# Altium project AudioUSB.PrjPcb
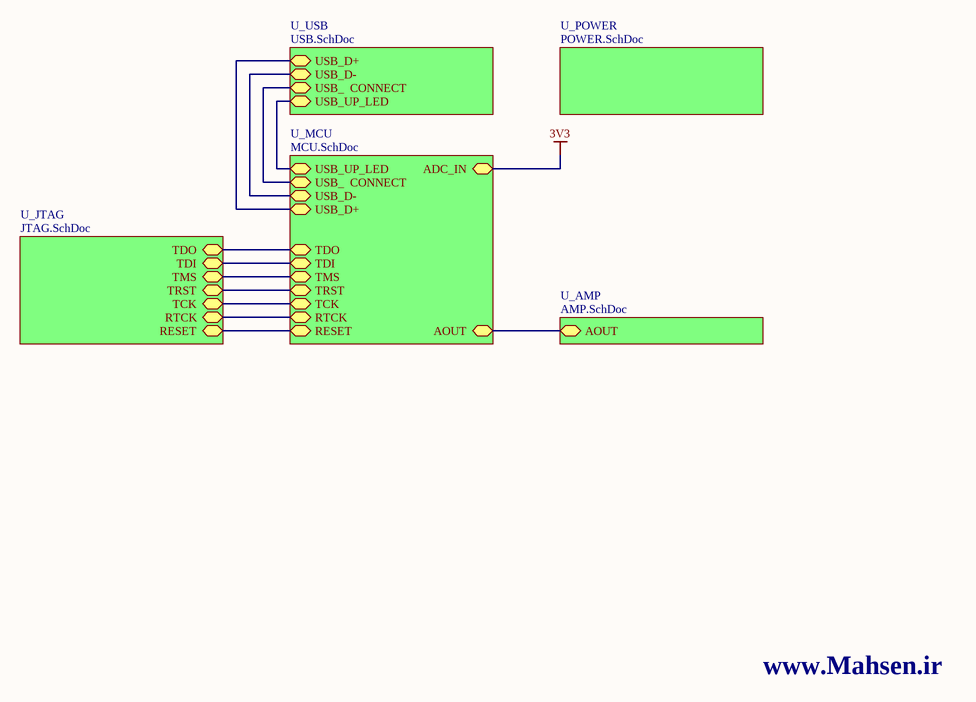
[diagram p0: TopSheet.SchDoc]
6 sheets, 50 parts. Net scope: hierarchical (ports join the sheet entries above them; power ports are global).
Board file: MainPCB.PcbDoc
Sheets:
  TopSheet.SchDoc
    U_AMP = AMP.SchDoc
    U_JTAG = JTAG.SchDoc
    U_MCU = MCU.SchDoc
    U_POWER = POWER.SchDoc
    U_USB = USB.SchDoc

## Sheet TopSheet.SchDoc
size A

### Sub-sheets
U_AMP = AMP.SchDoc: AOUT (bidir)
U_JTAG = JTAG.SchDoc: TDO (bidir), TDI (bidir), TMS (bidir), TRST (bidir), TCK (bidir), RTCK (bidir), RESET (bidir)
U_MCU = MCU.SchDoc: USB_UP_LED (bidir), ADC_IN (bidir), USB_  CONNECT (bidir), AOUT (bidir), USB_D+ (bidir), USB_D- (bidir), TDO (bidir), TDI (bidir), TMS (bidir), TRST (bidir), TCK (bidir), RTCK (bidir), RESET (bidir)
U_POWER = POWER.SchDoc: no entries
U_USB = USB.SchDoc: USB_D+ (bidir), USB_D- (bidir), USB_  CONNECT (bidir), USB_UP_LED (bidir)

### Nets
NetC1_1: sheet U_JTAG/RESET, sheet U_MCU/RESET
NetC15_2: sheet U_AMP/AOUT, sheet U_MCU/AOUT
NetC17_2: sheet U_MCU/USB_D-, sheet U_USB/USB_D-
NetC18_1: sheet U_MCU/USB_D+, sheet U_USB/USB_D+
NetCN2_3: sheet U_JTAG/TRST, sheet U_MCU/TRST
NetCN2_5: sheet U_JTAG/TDI, sheet U_MCU/TDI
NetCN2_7: sheet U_JTAG/TMS, sheet U_MCU/TMS
NetCN2_9: sheet U_JTAG/TCK, sheet U_MCU/TCK
NetCN2_11: sheet U_JTAG/RTCK, sheet U_MCU/RTCK
NetCN2_13: sheet U_JTAG/TDO, sheet U_MCU/TDO
NetU1_32: sheet U_MCU/USB_UP_LED, sheet U_USB/USB_UP_LED
NetU1_64: sheet U_MCU/USB_  CONNECT, sheet U_USB/USB_  CONNECT

### Notes on the sheet
- www.Mahsen.ir

## Sheet AMP.SchDoc
size A
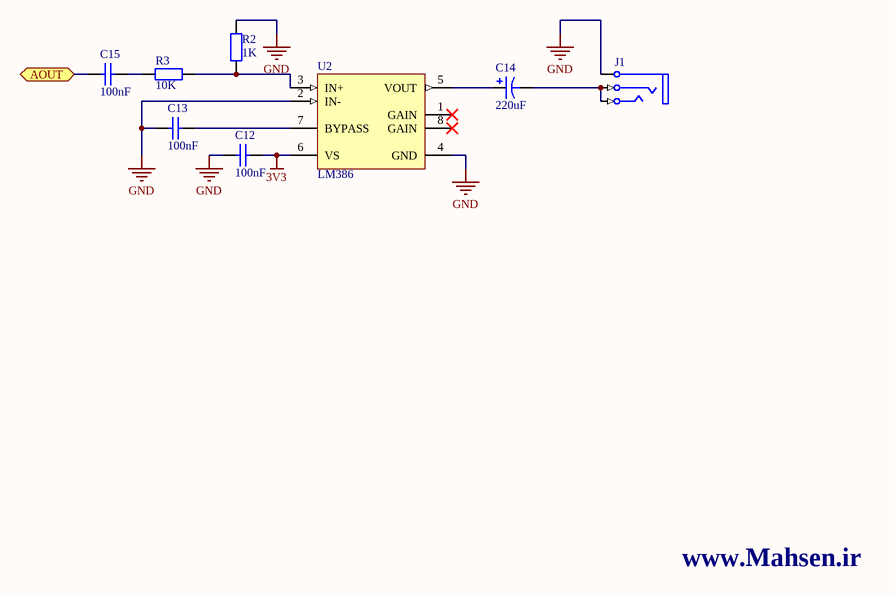
[diagram p1: AMP.SchDoc]

### Parts
C12  100nF  [0805]
C13  100nF  [0805]
C14  220uF  [C0805]
C15  100nF  [0805]
J1  Phonejack3  [JACK/6-V3]  (value not drawn)
R2  1K  [0805]
R3  10K  [0805]
U2  LM386  [M08A_L]

### Ports
AOUT (bidir)

### Nets
3V3: C12.1 U2.6(VS)
GND: C12.2 C13.2 J1.5(S) R2.2 U2.2(IN-) U2.4(GND)
NetC13_1: C13.1 U2.7(BYPASS)
NetC14_1: C14.1 U2.5(VOUT)
NetC14_2: C14.2 J1.1(T) J1.3(R)
NetC15_1: C15.1 R3.1
NetC15_2: C15.2 ; port AOUT
NetR2_1: R2.1 R3.2 U2.3(IN+)

Not connected (* = marked no-connect by the designer): U2 1(GAIN)* 8(GAIN)*

### Notes on the sheet
- www.Mahsen.ir

### Library data of the parts
C12 C13 C15 = Cap: Capacitor; Published: 8-Jun-2000; LatestRevisionDate: 17-Jul-2002; LatestRevisionNote: Re-released for DXP Platform.; PackageReference: RAD-0.3; Publisher: Altium Limited; PackageDescription: Radial Cap, Thru-Hole; 2 Leads; 0.3 in Pin Spacing; Value: 100nF
C14 = Cap Pol3: Polarized Capacitor (Surface Mount); Published: 8-Jun-2000; LatestRevisionDate: 29-May-2009; LatestRevisionNote: IPC-7351 Footprint Added.; PackageReference: C0805; Publisher: Altium Limited; PackageDescription: Chip Capacitor; Value: 220uF
J1 = Phonejack3: Jack Socket, 1/4" [6.5mm], Thru-Hole, Vertical, 3-Conductor Open Circuit (Non-Normalling); PackageDocument: 2003; PCB_Layout: Complies with manufacturer's recommendation.; DrillAndSlotSize: Corresponds to nominal value.; Published: 15-Jul-2004; LatestRevisionDate: 15-Jul-2004; LatestRevisionNote: Component Replaced.; DatasheetDocument: 2003; PackageReference: S1VS_SSS; Publisher: Altium Limited; ComponentLink1Description: Manufacturer Link; ComponentLink1URL: http://www.cliffuk.co.uk/
R2 R3 = Res2: Resistor; Published: 8-Jun-2000; LatestRevisionDate: 17-Jul-2002; LatestRevisionNote: Re-released for DXP Platform.; PackageReference: AXIAL-0.4; Publisher: Altium Limited; PackageDescription: Axial Device, Thru-Hole; 2 Leads; 0.4 in Pin Spacing
  R2: Value: 1K
  R3: Value: 10K
U2 = LM386MX-1: Low Voltage Audio Power Amplifier, 8-pin Narrow SOIC; Manufacturer: National Semiconductor; PackageTopMarking: NSZXTT*LM386*M-1; PowerWise: N; CompType: Audio IC; Published: 1-Mar-2010; DatasheetVersion: Aug-2000; PackageVersion: revM, May-2009; PackageReference: M08A; Publisher: Altium Limited; PackageDescription: SOIC Narrow, 4.9 x 3.9 x 1.45mm, 8 Lead, 1.27mm Pitch; PartNumber: LM386MX-1; RoHS: N; PinCount: 8; Code_JEDEC: MS-012-AA; Code_IPC: SOIC127P600-8; ComponentLink1Description: LM386 Datasheet; ComponentLink1URL: http://www.national.com/ds/LM/LM386.pdf; ComponentLink2Description: LM386 Web Page; ComponentLink2URL: http://www.national.com/pf/LM/LM386.html; ComponentLink3Description: M08A Package Page; ComponentLink3URL: http://www.national.com/packaging/folders/m08a.html

## Sheet JTAG.SchDoc
size A
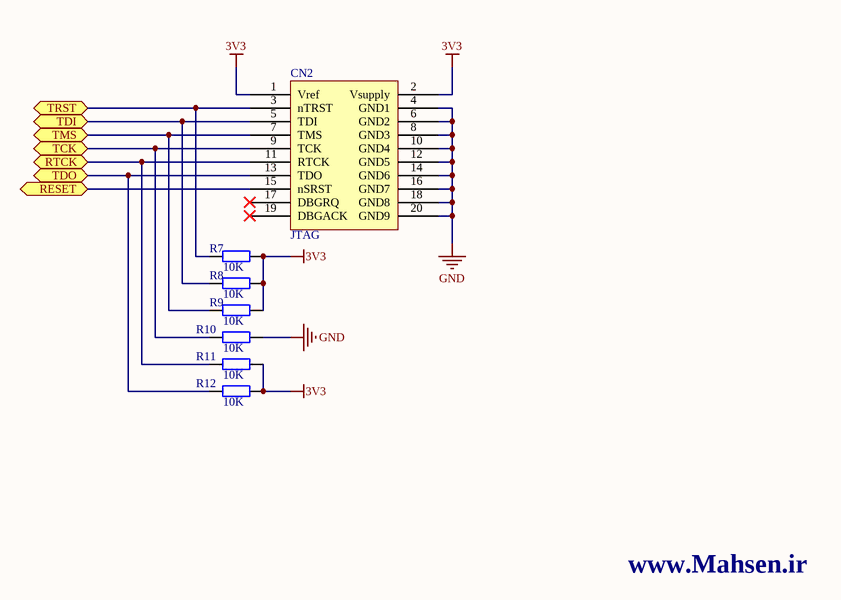
[diagram p2: JTAG.SchDoc]

### Parts
CN2  JTAG  [FKV20SN]
R7  10K  [0805]
R8  10K  [0805]
R9  10K  [0805]
R10  10K  [0805]
R11  10K  [0805]
R12  10K  [0805]

### Ports
RESET (bidir), RTCK (bidir), TCK (bidir), TDI (bidir), TDO (bidir), TMS (bidir), TRST (bidir)

### Nets
3V3: CN2.1(Vref) CN2.2(Vsupply) R7.1 R8.1 R9.1 R11.1 R12.1
GND: CN2.4(GND1) CN2.6(GND2) CN2.8(GND3) CN2.10(GND4) CN2.12(GND5) CN2.14(GND6) CN2.16(GND7) CN2.18(GND8) CN2.20(GND9) R10.1
NetC1_1: CN2.15(nSRST) ; port RESET
NetCN2_3: CN2.3(nTRST) R7.2 ; port TRST
NetCN2_5: CN2.5(TDI) R8.2 ; port TDI
NetCN2_7: CN2.7(TMS) R9.2 ; port TMS
NetCN2_9: CN2.9(TCK) R10.2 ; port TCK
NetCN2_11: CN2.11(RTCK) R11.2 ; port RTCK
NetCN2_13: CN2.13(TDO) R12.2 ; port TDO

Not connected (* = marked no-connect by the designer): CN2 17(DBGRQ)* 19(DBGACK)*

### Notes on the sheet
- www.Mahsen.ir

### Library data of the parts
R7-R12 = Res2: Resistor; Published: 8-Jun-2000; LatestRevisionDate: 17-Jul-2002; LatestRevisionNote: Re-released for DXP Platform.; PackageReference: AXIAL-0.4; Publisher: Altium Limited; PackageDescription: Axial Device, Thru-Hole; 2 Leads; 0.4 in Pin Spacing; Value: 10K

## Sheet MCU.SchDoc
size A4
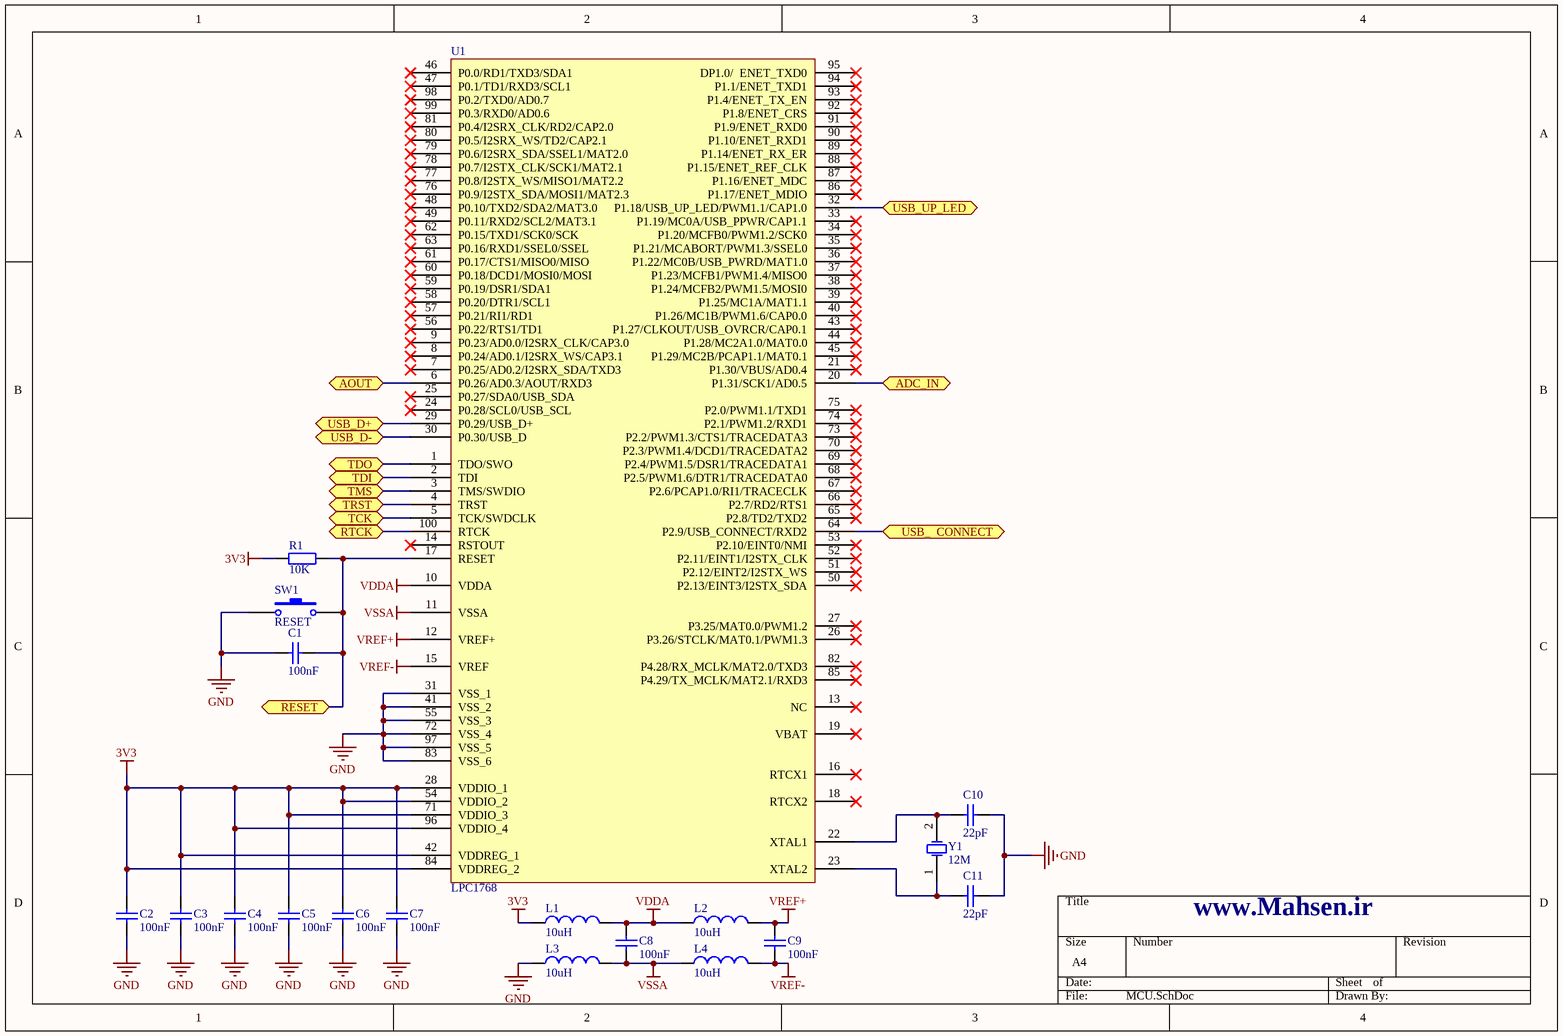
[diagram p3: MCU.SchDoc]

### Parts
C1  100nF  [0805]
C2  100nF  [0805]
C3  100nF  [0805]
C4  100nF  [0805]
C5  100nF  [0805]
C6  100nF  [0805]
C7  100nF  [0805]
C8  100nF  [0805]
C9  100nF  [0805]
C10  22pF  [0805]
C11  22pF  [0805]
L1  10uH  [0402-A]
L2  10uH  [0402-A]
L3  10uH  [0402-A]
L4  10uH  [0402-A]
R1  10K  [0805]
SW1  RESET  [SPST-2]
U1  LPC1768  [LQFP_100]
Y1  12M  [R38]

### Ports
ADC_IN (bidir), AOUT (bidir), RESET (bidir), RTCK (bidir), TCK (bidir), TDI (bidir), TDO (bidir), TMS (bidir), TRST (bidir), USB_  CONNECT (bidir), USB_D+ (bidir), USB_D- (bidir), USB_UP_LED (bidir)

### Nets
3V3: C2.1 C3.1 C4.1 C5.1 C6.1 C7.1 L1.1 R1.1 U1.20(P1.31/SCK1/AD0.5) U1.28(VDDIO_1) U1.42(VDDREG_1) U1.54(VDDIO_2) U1.71(VDDIO_3) U1.84(VDDREG_2) U1.96(VDDIO_4) ; port ADC_IN
GND: C1.2 C2.2 C3.2 C4.2 C5.2 C6.2 C7.2 C10.2 C11.1 L3.1 SW1.1 U1.31(VSS_1) U1.41(VSS_2) U1.55(VSS_3) U1.72(VSS_4) U1.83(VSS_6) U1.97(VSS_5)
VDDA: C8.1 L1.2 L2.1 U1.10(VDDA)
VREF+: C9.1 L2.2 U1.12(VREF+)
VREF-: C9.2 L4.2 U1.15(VREF)
VSSA: C8.2 L3.2 L4.1 U1.11(VSSA)
NetC1_1: C1.1 R1.2 SW1.2 U1.17(RESET) ; port RESET
NetC10_1: C10.1 U1.22(XTAL1) Y1.2(OSC2)
NetC11_2: C11.2 U1.23(XTAL2) Y1.1(OSC1)
NetC15_2: U1.6(P0.26/AD0.3/AOUT/RXD3) ; port AOUT
NetC17_2: U1.30(P0.30/USB_D) ; port USB_D-
NetC18_1: U1.29(P0.29/USB_D+) ; port USB_D+
NetCN2_3: U1.4(TRST) ; port TRST
NetCN2_5: U1.2(TDI) ; port TDI
NetCN2_7: U1.3(TMS/SWDIO) ; port TMS
NetCN2_9: U1.5(TCK/SWDCLK) ; port TCK
NetCN2_11: U1.100(RTCK) ; port RTCK
NetCN2_13: U1.1(TDO/SWO) ; port TDO
NetU1_32: U1.32(P1.18/USB_UP_LED/PWM1.1/CAP1.0) ; port USB_UP_LED
NetU1_64: U1.64(P2.9/USB_CONNECT/RXD2) ; port USB_  CONNECT

Not connected (* = marked no-connect by the designer): U1 7(P0.25/AD0.2/I2SRX_SDA/TXD3)* 8(P0.24/AD0.1/I2SRX_WS/CAP3.1)* 9(P0.23/AD0.0/I2SRX_CLK/CAP3.0)* 13(NC)* 14(RSTOUT)* 16(RTCX1)* 18(RTCX2)* 19(VBAT)* 21(P1.30/VBUS/AD0.4)* 24(P0.28/SCL0/USB_SCL)* 25(P0.27/SDA0/USB_SDA)* 26(P3.26/STCLK/MAT0.1/PWM1.3)* 27(P3.25/MAT0.0/PWM1.2)* 33(P1.19/MC0A/USB_PPWR/CAP1.1)* 34(P1.20/MCFB0/PWM1.2/SCK0)* 35(P1.21/MCABORT/PWM1.3/SSEL0)* 36(P1.22/MC0B/USB_PWRD/MAT1.0)* 37(P1.23/MCFB1/PWM1.4/MISO0)* 38(P1.24/MCFB2/PWM1.5/MOSI0)* 39(P1.25/MC1A/MAT1.1)* 40(P1.26/MC1B/PWM1.6/CAP0.0)* 43(P1.27/CLKOUT/USB_OVRCR/CAP0.1)* 44(P1.28/MC2A1.0/MAT0.0)* 45(P1.29/MC2B/PCAP1.1/MAT0.1)* 46(P0.0/RD1/TXD3/SDA1)* 47(P0.1/TD1/RXD3/SCL1)* 48(P0.10/TXD2/SDA2/MAT3.0)* 49(P0.11/RXD2/SCL2/MAT3.1)* 50(P2.13/EINT3/I2STX_SDA)* 51(P2.12/EINT2/I2STX_WS)* 52(P2.11/EINT1/I2STX_CLK)* 53(P2.10/EINT0/NMI)* 56(P0.22/RTS1/TD1)* 57(P0.21/RI1/RD1)* 58(P0.20/DTR1/SCL1)* 59(P0.19/DSR1/SDA1)* 60(P0.18/DCD1/MOSI0/MOSI)* 61(P0.17/CTS1/MISO0/MISO)* 62(P0.15/TXD1/SCK0/SCK)* 63(P0.16/RXD1/SSEL0/SSEL)* 65(P2.8/TD2/TXD2)* 66(P2.7/RD2/RTS1)* 67(P2.6/PCAP1.0/RI1/TRACECLK)* 68(P2.5/PWM1.6/DTR1/TRACEDATA0)* 69(P2.4/PWM1.5/DSR1/TRACEDATA1)* 70(P2.3/PWM1.4/DCD1/TRACEDATA2)* 73(P2.2/PWM1.3/CTS1/TRACEDATA3)* 74(P2.1/PWM1.2/RXD1)* 75(P2.0/PWM1.1/TXD1)* 76(P0.9/I2STX_SDA/MOSI1/MAT2.3)* 77(P0.8/I2STX_WS/MISO1/MAT2.2)* 78(P0.7/I2STX_CLK/SCK1/MAT2.1)* 79(P0.6/I2SRX_SDA/SSEL1/MAT2.0)* 80(P0.5/I2SRX_WS/TD2/CAP2.1)* 81(P0.4/I2SRX_CLK/RD2/CAP2.0)* 82(P4.28/RX_MCLK/MAT2.0/TXD3)* 85(P4.29/TX_MCLK/MAT2.1/RXD3)* 86(P1.17/ENET_MDIO)* 87(P1.16/ENET_MDC)* 88(P1.15/ENET_REF_CLK)* 89(P1.14/ENET_RX_ER)* 90(P1.10/ENET_RXD1)* 91(P1.9/ENET_RXD0)* 92(P1.8/ENET_CRS)* 93(P1.4/ENET_TX_EN)* 94(P1.1/ENET_TXD1)* 95(DP1.0/__ENET_TXD0)* 98(P0.2/TXD0/AD0.7)* 99(P0.3/RXD0/AD0.6)*

### Notes on the sheet
- www.Mahsen.ir

### Library data of the parts
C1-C11 = Cap: Capacitor; Published: 8-Jun-2000; LatestRevisionDate: 17-Jul-2002; LatestRevisionNote: Re-released for DXP Platform.; PackageReference: RAD-0.3; Publisher: Altium Limited; PackageDescription: Radial Cap, Thru-Hole; 2 Leads; 0.3 in Pin Spacing
  C1-C9: Value: 100nF
  C10 C11: Value: 22pF
L1-L4 = Inductor: Code_IEC: 1005; Published: 8-Jun-2000; LatestRevisionDate: 29-May-2009; LatestRevisionNote: IPC-7351 Footprint Added.; PackageReference: 0402-A; Publisher: Altium Limited; PackageDescription: Chip Inductor; Code_JEITA: 0402; Value: 10uH
R1 = Res2: Resistor; Published: 8-Jun-2000; LatestRevisionDate: 17-Jul-2002; LatestRevisionNote: Re-released for DXP Platform.; PackageReference: AXIAL-0.4; Publisher: Altium Limited; PackageDescription: Axial Device, Thru-Hole; 2 Leads; 0.4 in Pin Spacing; Value: 10K
SW1 = SW-PB: Switch; Published: 24-Mar-1999; LatestRevisionDate: 17-Jul-2002; LatestRevisionNote: Re-released for DXP Platform.; PackageReference: SPST-2; Publisher: Altium Limited; PackageDescription: Switch; 2 Leads
Y1 = XTAL: Crystal Oscillator; Published: 8-Jun-2000; LatestRevisionDate: 17-Jul-2002; LatestRevisionNote: Re-released for DXP Platform.; PackageReference: R38; Publisher: Altium Limited; PackageDescription: Crystal, Thru-Hole; 2 Leads; Body 3.1 x 8.2 mm (Dia.xH); Value: 12M

## Sheet POWER.SchDoc
size A
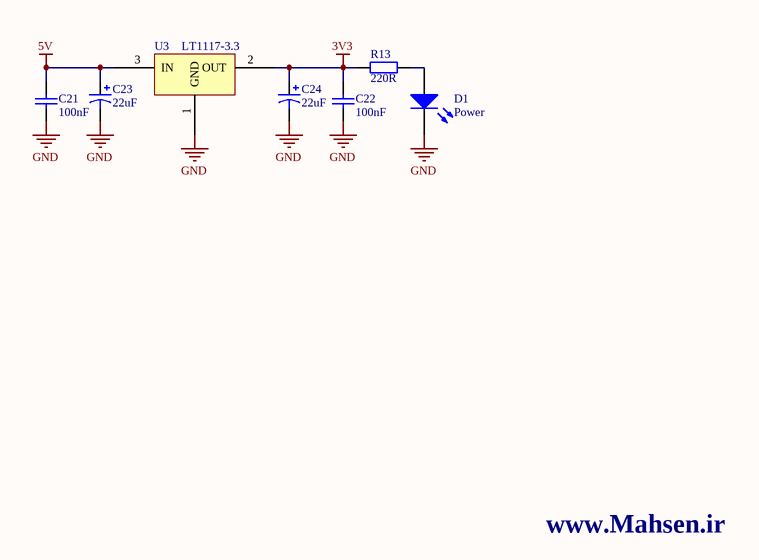
[diagram p4: POWER.SchDoc]

### Parts
C21  100nF  [0805]
C22  100nF  [0805]
C23  22uF  [C0805]
C24  22uF  [C0805]
D1  Power  [3.5X2.8X1.9]
R13  220R  [0805]
U3  LT1117-3.3  [SOT223_4]

### Nets
3V3: C22.1 C24.1 R13.1 U3.2(OUT)
5V: C21.1 C23.1 U3.3(IN)
GND: C21.2 C22.2 C23.2 C24.2 D1.2(K) U3.1(GND)
NetD1_1: D1.1(A) R13.2

### Notes on the sheet
- www.Mahsen.ir

### Library data of the parts
C21 C22 = Cap: Capacitor; Published: 8-Jun-2000; LatestRevisionDate: 17-Jul-2002; LatestRevisionNote: Re-released for DXP Platform.; PackageReference: RAD-0.3; Publisher: Altium Limited; PackageDescription: Radial Cap, Thru-Hole; 2 Leads; 0.3 in Pin Spacing; Value: 100nF
C23 C24 = Cap Pol3: Polarized Capacitor (Surface Mount); Published: 8-Jun-2000; LatestRevisionDate: 29-May-2009; LatestRevisionNote: IPC-7351 Footprint Added.; PackageReference: C0805; Publisher: Altium Limited; PackageDescription: Chip Capacitor; Value: 22uF
D1 = LED3: Typical BLUE SiC LED; Published: 8-Jun-2000; LatestRevisionDate: 17-Dec-2003; LatestRevisionNote: PCB Footprint replaced.; DatasheetVersion: 16-Apr-2002; PackageVersion: 16-Apr-2002; PackageReference: 3.5X2.8X1.9; Publisher: Altium Limited; PackageDescription: SM LED; 2 C-Bend Leads; Body 3.5 x 2.8 x 1.9 mm, inc leads (LxWxH typ)
R13 = Res2: Resistor; Published: 8-Jun-2000; LatestRevisionDate: 17-Jul-2002; LatestRevisionNote: Re-released for DXP Platform.; PackageReference: AXIAL-0.4; Publisher: Altium Limited; PackageDescription: Axial Device, Thru-Hole; 2 Leads; 0.4 in Pin Spacing; Value: 220R

## Sheet USB.SchDoc
size A
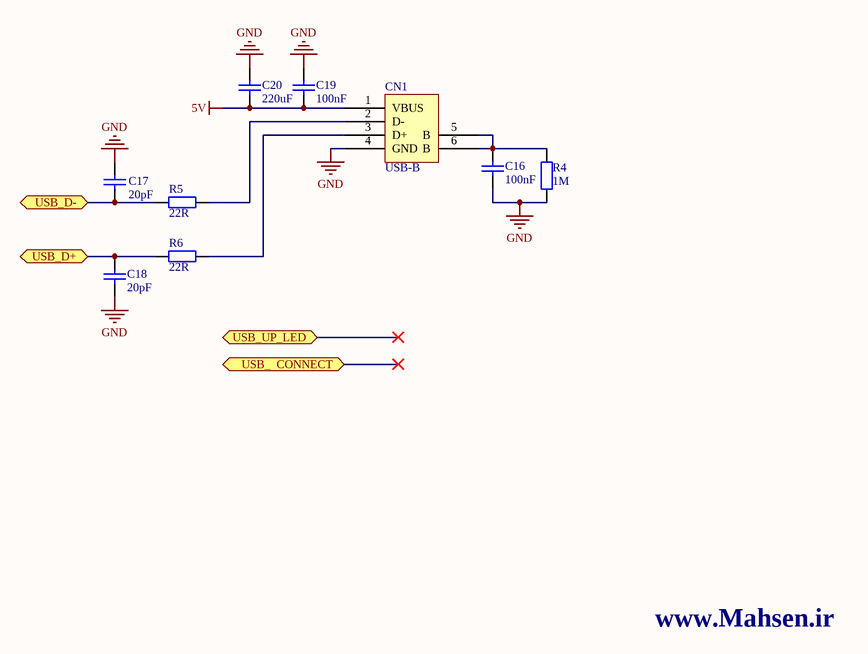
[diagram p5: USB.SchDoc]

### Parts
C16  100nF  [0805]
C17  20pF  [0805]
C18  20pF  [0805]
C19  100nF  [0805]
C20  220uF  [0805]
CN1  USB-B  [CONN_USB]
R4  1M  [0805]
R5  22R  [0805]
R6  22R  [0805]

### Ports
USB_  CONNECT (bidir), USB_D+ (bidir), USB_D- (bidir), USB_UP_LED (bidir)

### Nets
5V: C19.2 C20.2 CN1.1(VBUS)
GND: C16.2 C17.1 C18.2 C19.1 C20.1 CN1.4(GND) R4.1
NetC16_1: C16.1 CN1.5(B) CN1.6(B) R4.2
NetC17_2: C17.2 R5.2 ; port USB_D-
NetC18_1: C18.1 R6.2 ; port USB_D+
NetCN1_2: CN1.2(D-) R5.1
NetCN1_3: CN1.3(D+) R6.1

### Notes on the sheet
- www.Mahsen.ir

### Library data of the parts
C16-C20 = Cap: Capacitor; Published: 8-Jun-2000; LatestRevisionDate: 17-Jul-2002; LatestRevisionNote: Re-released for DXP Platform.; PackageReference: RAD-0.3; Publisher: Altium Limited; PackageDescription: Radial Cap, Thru-Hole; 2 Leads; 0.3 in Pin Spacing
  C16 C19: Value: 100nF
  C17 C18: Value: 20pF
  C20: Value: 220uF
R4-R6 = Res2: Resistor; Published: 8-Jun-2000; LatestRevisionDate: 17-Jul-2002; LatestRevisionNote: Re-released for DXP Platform.; PackageReference: AXIAL-0.4; Publisher: Altium Limited; PackageDescription: Axial Device, Thru-Hole; 2 Leads; 0.4 in Pin Spacing
  R4: Value: 1M
  R5 R6: Value: 22R

## Nets that join several sheets
3V3: AMP (C12.1 U2.6), JTAG (7 pins), MCU (15 pins), POWER (C22.1 C24.1 R13.1 U3.2)
5V: POWER (C21.1 C23.1 U3.3), USB (C19.2 C20.2 CN1.1)
GND: AMP (6 pins), JTAG (10 pins), MCU (17 pins), POWER (6 pins), USB (7 pins)
NetC1_1: JTAG (CN2.15), MCU (C1.1 R1.2 SW1.2 U1.17)
NetC15_2: AMP (C15.2), MCU (U1.6)
NetC17_2: MCU (U1.30), USB (C17.2 R5.2)
NetC18_1: MCU (U1.29), USB (C18.1 R6.2)
NetCN2_3: JTAG (CN2.3 R7.2), MCU (U1.4)
NetCN2_5: JTAG (CN2.5 R8.2), MCU (U1.2)
NetCN2_7: JTAG (CN2.7 R9.2), MCU (U1.3)
NetCN2_9: JTAG (CN2.9 R10.2), MCU (U1.5)
NetCN2_11: JTAG (CN2.11 R11.2), MCU (U1.100)
NetCN2_13: JTAG (CN2.13 R12.2), MCU (U1.1)